# Altium schematic sheet 03_Power.SchDoc
size A3; SheetNumber: 3; SheetTotal: 9
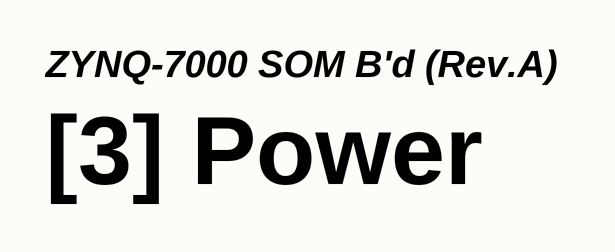
[diagram p0: 03_Power.SchDoc]

## Notes on the sheet
- ZYNQ-7000 SOM B'd (Rev.A)
- [3] Power
- Title
- Rev
- Doc
- Sheet #
- of
- Author
- This document is copyright of ArkX and shall not be revealed, produced, copied, in whole or in part,
- Date
- nor used for any purpose other than submitted.